# Altium schematic sheet 01.SchDoc: Pickit 2
size 146 x 96 mm; SheetNumber: 1; SheetTotal: 3; PageSetup: Record=PageOptions|CenterHorizontal=True|CenterVertical=True|PrintScale=1.88|XCorrection=1.00|YCorrection=1.00|PrintKind=0|BorderSize=5000000|LeftOffset=0|BottomOffset=0|Orientation=2|PaperLength=1000|PaperWidth=1000|Scale=100|PaperSource=7|PrintQuality=-4|MediaType=1|DitherType=10|PaperKind=Letter|PrintScaleMode=1
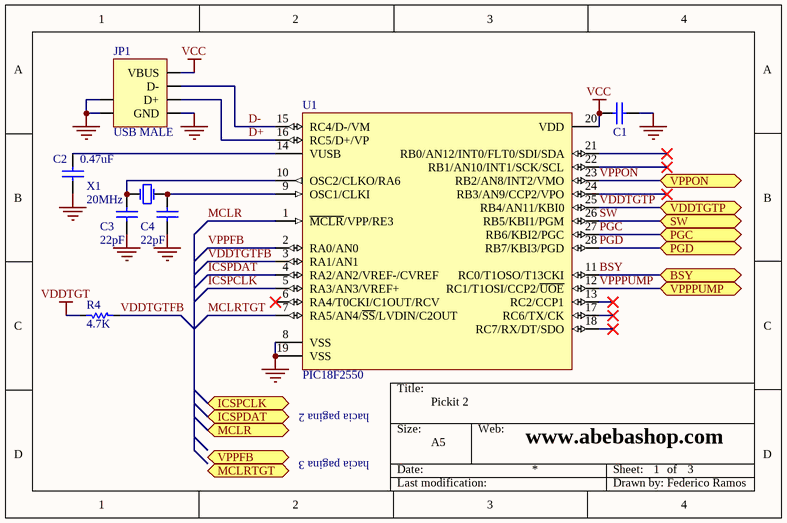
[diagram p0: 01.SchDoc]

## Parts
C1  Cap  [1206NP]  (value not drawn)
C2  value 0.47uF  [1206NP]  (hidden comment: Cap)
C3  value 22pF  [1206NP]  (hidden comment: Cap)
C4  value 22pF  [1206NP]  (hidden comment: Cap)
JP1  USB MALE  [USB_A_MALE]
R4  value 4.7K  [1206NP]  (hidden comment: Res)
U1  PIC18F2550  [soic28]
X1  value 20MHz  [XTAL1]  (hidden comment: XTAL)

## Ports
BSY, ICSPCLK, ICSPDAT, MCLR, MCLRTGT, PGC, PGD, SW, VDDTGTP, VPPFB, VPPON, VPPPUMP

## Nets
GND: C1.1 C2.1 C3.1 C4.2 JP1.4(GND) JP1.5 JP1.6 U1.8(VSS) U1.19(VSS)
VCC: C1.2 JP1.1(VBUS) U1.20(VDD)
VDDTGT: R4.2
BSY: U1.11(RC0/T1OSO/T13CKI) ; port BSY
D+: JP1.3(D+) U1.16(RC5/D+/VP)
D-: JP1.2(D-) U1.15(RC4/D-/VM)
ICSPCLK: U1.5(RA3/AN3/VREF+)
ICSPDAT: U1.4(RA2/AN2/VREF-/CVREF)
MCLR: U1.1(~{MCLR}/VPP/RE3)
MCLRTGT: U1.7(RA5/AN4/~{SS}/LVDIN/C2OUT)
PGC: U1.27(RB6/KBI2/PGC) ; port PGC
PGD: U1.28(RB7/KBI3/PGD) ; port PGD
SW: U1.26(RB5/KBI1/PGM) ; port SW
VDDTGTFB: R4.1 U1.3(RA1/AN1)
VDDTGTP: U1.25(RB4/AN11/KBI0) ; port VDDTGTP
VPPFB: U1.2(RA0/AN0)
VPPON: U1.23(RB2/AN8/INT2/VMO) ; port VPPON
VPPPUMP: U1.12(RC1/T1OSI/CCP2/~{UOE}) ; port VPPPUMP
NetC2_2: C2.2 U1.14(VUSB)
NetC3_2: C3.2 U1.10(OSC2/CLKO/RA6) X1.1(OSC1)
NetC4_1: C4.1 U1.9(OSC1/CLKI) X1.2(OSC2)

Not connected (* = marked no-connect by the designer): U1 6(RA4/T0CKI/C1OUT/RCV)* 13(RC2/CCP1)* 17(RC6/TX/CK)* 18(RC7/RX/DT/SDO)* 21(RB0/AN12/INT0/FLT0/SDI/SDA)* 22(RB1/AN10/INT1/SCK/SCL)* 24(RB3/AN9/CCP2/VPO)*

## Notes on the sheet
- hacia pagina 2
- hacia pagina 3
- Title:
- Size:
- Date:
- A5
- Web:
- www.abebashop.com
- Sheet:
- of
- Last modification:
- Drawn by: Federico Ramos

## Library data of the parts
C1 = Cap: Capacitor; Voltage: 50V; Value: 100nF; Price: 0.25; Technology: Ceramic
C2-C4 = Cap: Capacitor; Voltage: 50V; Price: 0.25; Technology: Ceramic
JP1 = USB: USB Connector; Price: ?
R4 = Res: Resistor; Power: 0.25W; Price: 0.036
U1 = PIC18F2550: Enhanced FLASH Microcontroller
X1 = XTAL: Crystal Oscillator; Price: ?